# Altium project ProbadorDeCables.PrjPcb
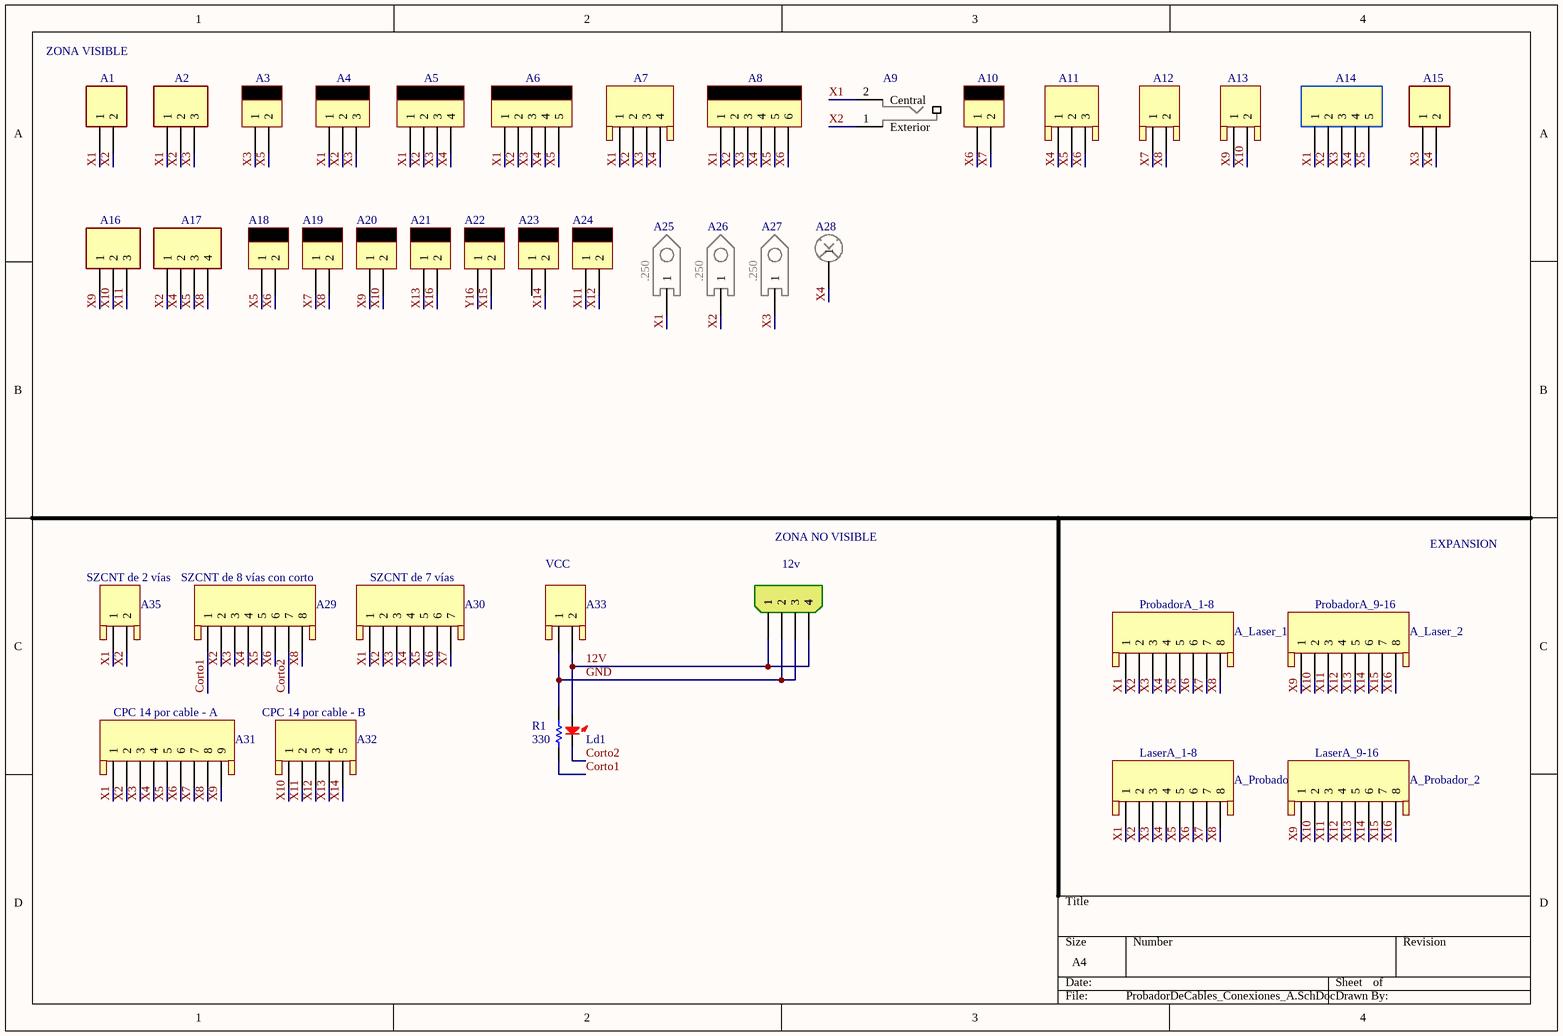
[diagram p0: ProbadorDeCables_Conexiones_A.SchDoc]
12 sheets, 118 parts. Net scope: global (net labels, ports and power ports of the same name join across sheets).
Board file: ProbadorDeCables.PcbDoc
Sheets:
  ProbadorDeCables_Conexiones_A.SchDoc
  ProbadorDeCables_Conexiones_B.SchDoc
  ProbadorDeCables_Accesorios_A.SchDoc
  ProbadorDeCables_Accesorios_A_SZCNT_2.SchDoc
  ProbadorDeCables_Accesorios_A_RCA.SchDoc
  ProbadorDeCables_Accesorios_B_SZCNT_2.SchDoc
  ProbadorDeCables_Accesorios_B_SZCNT_7.SchDoc
  ProbadorDeCables_Accesorios_B_SZCNT_8.SchDoc
  ProbadorDeCables_Accesorios_B_RCA.SchDoc
  ProbadorDeCables_Accesorios_B_CST100_Bomba.SchDoc
  ProbadorDeCables_Accesorios_B_RJ11.SchDoc
  ProbadorDeCables_Accesorios_B_Interlock.SchDoc

## Sheet ProbadorDeCables_Conexiones_A.SchDoc
size A4

### Parts
12v  MAZ 103 y 104  [794285-1]  (value not drawn)
A1  JST_2.5_2  [B2B-XH-A]  (value not drawn)
A2  JST_2.5_3  [B3B-XH-A]  (value not drawn)
A3  Para_SL-156__640445-2  [640445-2]  (value not drawn)
A4  Para_SL-156__640445-3  [640445-3]  (value not drawn)
A5  Para_SL-156__640445-4  [640445-4]  (value not drawn)
A6  Para_SL-156__640445-5  [640445-5]  (value not drawn)
A7  Para_CST_100__640456-4  [640456-4]  (value not drawn)
A8  Para_SL-156__640445-6  [640445-6]  (value not drawn)
A9  RCA mono para placa - Negro  [RCJ-021]  (value not drawn)
A10  Para_SL-156__640445-2  [640445-2]  (value not drawn)
A11  Para_CST_100__640456-3  [640456-3]  (value not drawn)
A12  Para_CST_100__640456-2  [640456-2]  (value not drawn)
A13  Para_CST_100__640456-2  [640456-2]  (value not drawn)
A14  USB 2_0 micro B  [USB2.0_MicroB]  (value not drawn)
A15  JST_2.5_2  [B2B-XH-A]  (value not drawn)
A16  JST_2.5_3  [B3B-XH-A]  (value not drawn)
A17  JST_2.5_4  [B4B-XH-A]  (value not drawn)
A18  Para_SL-156__640445-2  [640445-2]  (value not drawn)
A19  Para_SL-156__640445-2  [640445-2]  (value not drawn)
A20  Para_SL-156__640445-2  [640445-2]  (value not drawn)
A21  Para_SL-156__640445-2  [640445-2]  (value not drawn)
A22  Para_SL-156__640445-2  [640445-2]  (value not drawn)
A23  Para_SL-156__640445-2  [640445-2]  (value not drawn)
A24  Para_SL-156__640445-2  [640445-2]  (value not drawn)
A25  Pala macho 6.3 para placa  [Pala macho 6.3 para placa]  (value not drawn)
A26  Pala macho 6.3 para placa  [Pala macho 6.3 para placa]  (value not drawn)
A27  Pala macho 6.3 para placa  [Pala macho 6.3 para placa]  (value not drawn)
A28  SCREW M4 4 PIN PCB  [SCREW M4 4 PIN PCB]  (value not drawn)
A29  SZCNT de 8 vías con corto  [640456-8]
A30  SZCNT de 7 vías  [640456-7]
A31  CPC 14 por cable - A  [640456-9]
A32  CPC 14 por cable - B  [640456-5]
A33  VCC  [640456-2]
A35  SZCNT de 2 vías  [640456-2]
A_Laser_1  ProbadorA_1-8  [640456-8]
A_Laser_2  ProbadorA_9-16  [640456-8]
A_Probador_1  LaserA_1-8  [640456-8]
A_Probador_2  LaserA_9-16  [640456-8]
Ld1  PinesParaLed  [Jumper-Simple]  (value not drawn)
R1  330  [R_0805]

### Nets
12V: 12v.1 12v.4 A33.2 Ld1.1
Corto1: A29.1 R1.1
Corto2: A29.7 Ld1.2
GND: 12v.2 12v.3 A33.1 R1.2
X1: A1.1 A2.1 A4.1 A5.1 A6.1 A7.1 A8.1 A9.2(Central) A14.1 A25.1 A30.1 A31.1 A35.1 A_Laser_1.1 A_Probador_1.1
X2: A1.2 A2.2 A4.2 A5.2 A6.2 A7.2 A8.2 A9.1(Exterior) A14.2 A17.1 A26.1 A29.2 A30.2 A31.2 A35.2 A_Laser_1.2 A_Probador_1.2
X3: A2.3 A3.1 A4.3 A5.3 A6.3 A7.3 A8.3 A14.3 A15.1 A27.1 A29.3 A30.3 A31.3 A_Laser_1.3 A_Probador_1.3
X4: A5.4 A6.4 A7.4 A8.4 A11.1 A14.4 A15.2 A17.2 A28.1 A29.4 A30.4 A31.4 A_Laser_1.4 A_Probador_1.4
X5: A3.2 A6.5 A8.5 A11.2 A14.5 A17.3 A18.1 A29.5 A30.5 A31.5 A_Laser_1.5 A_Probador_1.5
X6: A8.6 A10.1 A11.3 A18.2 A29.6 A30.6 A31.6 A_Laser_1.6 A_Probador_1.6
X7: A10.2 A12.1 A19.1 A30.7 A31.7 A_Laser_1.7 A_Probador_1.7
X8: A12.2 A17.4 A19.2 A29.8 A31.8 A_Laser_1.8 A_Probador_1.8
X9: A13.1 A16.1 A20.1 A31.9 A_Laser_2.1 A_Probador_2.1
X10: A13.2 A16.2 A20.2 A32.1 A_Laser_2.2 A_Probador_2.2
X11: A16.3 A24.1 A32.2 A_Laser_2.3 A_Probador_2.3
X12: A24.2 A32.3 A_Laser_2.4 A_Probador_2.4
X13: A21.1 A32.4 A_Laser_2.5 A_Probador_2.5
X14: A23.2 A32.5 A_Laser_2.6 A_Probador_2.6
X15: A22.2 A_Laser_2.7 A_Probador_2.7
X16: A21.2 A_Laser_2.8 A_Probador_2.8
Y16: A22.1

Not connected (* = marked no-connect by the designer): A23 1

### Notes on the sheet
- ZONA VISIBLE
- ZONA NO VISIBLE
- EXPANSION
- (in symbol Pala macho 6.3 para placa) .250

### Library data of the parts
12v = 794285-1: CONN HDR 4POS 0.2 TIN PCB; Fabricante: TE Connectivity AMP Connectors; Cod.Digikey: 794285-1-ND; Cod.Fabricante: 794285-1; DIGIKEYx100: 1.68330; ComponentLink2URL: https://www.te.com/commerce/DocumentDelivery/DDEController?Action=srchrtrv&DocNm=794285&DocType=Customer+Drawing&DocLang=English; ComponentLink2Description: Datasheet
A1 A15 = JST_2.5_2: CONN HEADER XH TOP 2POS 2.5MM; Cod.Fabricante: B2B-XH-A(LF)(SN); Fabricante: JST Sales America Inc.; LatestRevisionDate: 17-Jul-2002; LatestRevisionNote: Re-released for DXP Platform.; Publisher: Altium Limited; Cod.Digikey: 455-2247-ND; DIGIKEYx50: 0.08980; ComponentLink2URL: http://www.jst-mfg.com/product/pdf/eng/eXH.pdf; ComponentLink2Description: Datasheet
A2 A16 = JST_2.5_3: CONN HEADER XH TOP 3POS 2.5MM; Cod.Fabricante: B3B-XH-A(LF)(SN); Fabricante: JST Sales America Inc.; LatestRevisionDate: 17-Jul-2002; LatestRevisionNote: Re-released for DXP Platform.; Publisher: Altium Limited; Cod.Digikey: 455-2248-ND; ComponentLink2Description: Datasheet; ComponentLink2URL: http://www.jst-mfg.com/product/pdf/eng/eXH.pdf; DIGIKEYx50: 0.11540
A3 A10 A18-A24 = Para_SL-156__640445-2: CONN HEADER VERT 2POS .156 TIN; Fabricante: TE Connectivity AMP Connectors; Cod.Digikey: A1971-ND; Cod.Fabricante: 640445-2; DIGIKEYx100: 0.07960; ComponentLink2URL: https://www.te.com/commerce/DocumentDelivery/DDEController?Action=srchrtrv&DocNm=640445&DocType=Customer+Drawing&DocLang=English; ComponentLink2Description: Datasheet
A4 = Para_SL-156__640445-3: CONN HEADER VERT 3POS .156 TIN; Fabricante: TE Connectivity AMP Connectors; Cod.Digikey: A19890-ND; Cod.Fabricante: 640445-3; DIGIKEYx100: 0.13710; ComponentLink2URL: https://www.te.com/commerce/DocumentDelivery/DDEController?Action=srchrtrv&DocNm=640445&DocType=Customer+Drawing&DocLang=English; ComponentLink2Description: Datasheet
A5 = Para_SL-156__640445-4: CONN HEADER VERT 4POS .156 TIN; Fabricante: TE Connectivity AMP Connectors; Cod.Digikey: A1972-ND; Cod.Fabricante: 640445-4; DIGIKEYx100: 0.18210; ComponentLink2URL: https://www.te.com/commerce/DocumentDelivery/DDEController?Action=srchrtrv&DocNm=640445&DocType=Customer+Drawing&DocLang=English; ComponentLink2Description: Datasheet
A6 = Para_SL-156__640445-5: CONN HEADER VERT 5POS .156 TIN; Fabricante: TE Connectivity AMP Connectors; Cod.Digikey: A19891-ND; Cod.Fabricante: 640445-5; DIGIKEYx100: 0.23490; ComponentLink2URL: https://www.te.com/commerce/DocumentDelivery/DDEController?Action=srchrtrv&DocNm=640445&DocType=Customer+Drawing&DocLang=English; ComponentLink2Description: Datasheet
A7 = Para_CST_100__640456-4: CONN HEADER VERT 4POS .100 TIN; Cod.Fabricante: 640456-2; Fabricante: TE Connectivity AMP Connectors; LatestRevisionDate: 17-Jul-2002; LatestRevisionNote: Re-released for DXP Platform.; Publisher: Altium Limited; Cod.Digikey: A1922-ND; DIGIKEYx100: 0.14850; ComponentLink2URL: http://www.te.com/commerce/DocumentDelivery/DDEController?Action=srchrtrv&DocNm=640456&DocType=Customer+Drawing&DocLang=English; ComponentLink2Description: Datasheet
A8 = Para_SL-156__640445-6: CONN HEADER VERT 6POS .156 TIN; Fabricante: TE Connectivity AMP Connectors; Cod.Digikey: A1973-ND; Cod.Fabricante: 640445-6; DIGIKEYx100: 0.28780; ComponentLink2URL: https://www.te.com/commerce/DocumentDelivery/DDEController?Action=srchrtrv&DocNm=640445&DocType=Customer+Drawing&DocLang=English; ComponentLink2Description: Datasheet
A9 = RCA mono para placa - Negro: CONN RCA JACK MONO 3.2MM PCB; Fabricante: CUI Devices; Cod.Digikey: CP-1406-ND; Cod.Fabricante: RCJ-021; DIGIKEYx100: 0.66880; ComponentLink2URL: https://www.cuidevices.com/product/resource/digikeypdf/rcj-02x.pdf; ComponentLink2Description: Datasheet
A11 = Para_CST_100__640456-3: CONN HEADER VERT 3POS .100 TIN; Fabricante: TE Connectivity AMP Connectors; LatestRevisionDate: 17-Jul-2002; LatestRevisionNote: Re-released for DXP Platform.; Publisher: Altium Limited; Cod.Digikey: A19470-ND; Cod.Fabricante: 640456-3; DIGIKEYx100: 0.08910; ComponentLink2URL: http://www.te.com/commerce/DocumentDelivery/DDEController?Action=srchrtrv&DocNm=640456&DocType=Customer+Drawing&DocLang=English; ComponentLink2Description: Datasheet
A12 A13 A33 A35 = Para_CST_100__640456-2: CONN HEADER VERT 2POS .100 TIN; Fabricante: TE Connectivity AMP Connectors; LatestRevisionDate: 17-Jul-2002; LatestRevisionNote: Re-released for DXP Platform.; Publisher: Altium Limited; Cod.Digikey: A1921-ND; Cod.Fabricante: 640456-2; DIGIKEYx100: 0.06630; ComponentLink2URL: http://www.te.com/commerce/DocumentDelivery/DDEController?Action=srchrtrv&DocNm=640456&DocType=Customer+Drawing&DocLang=English; ComponentLink2Description: Datasheet
A14 = USB 2_0 micro B: CONN RCPT USB2.0 MICRO B SMD R/A; Cod.Fabricante: USB3160-30-0170-0-C; Fabricante: GCT; Cod.Digikey: 2073-USB3160-30-0170-0-CCT-ND; ComponentLink2Description: Datasheet; ComponentLink2URL: https://gct.co/files/drawings/usb3160.pdf; DIGIKEYx100: 0.57750
A17 = JST_2.5_4: CONN HEADER XH TOP 4POS 2.5MM; Cod.Fabricante: B4B-XH-A(LF)(SN); Fabricante: JST Sales America Inc.; LatestRevisionDate: 17-Jul-2002; LatestRevisionNote: Re-released for DXP Platform.; Publisher: Altium Limited; Cod.Digikey: 455-2249-ND; ComponentLink2Description: Datasheet; ComponentLink2URL: http://www.jst-mfg.com/product/pdf/eng/eXH.pdf; DIGIKEYx100: 0.13480
A25-A27 = Pala macho 6.3 para placa: CONN QC TAB 0.250 SOLDER; Cod.Fabricante: 1217125-1; Fabricante: TE Connectivity AMP Connectors; Cod.DigiKey: A110909CT-ND; ComponentLink1Description: Manufacturer Link; ComponentLink1URL: https://www.te.com/commerce/DocumentDelivery/DDEController?Action=srchrtrv&DocNm=1217125&DocType=Customer+Drawing&DocLang=English; DIGIKEYx100: 0.17180
A28 = SCREW M4 4 PIN PCB: TERM SCREW M4 4 PIN PCB; Cod.Fabricante: 7795; Fabricante: Keystone Electronics; Cod.Digikey: 36-7795-ND; DIGIKEYx100: 0.38960; ComponentLink2URL: http://keyelco.com/userAssets/file/M65p69.pdf; ComponentLink2Description: Datasheet
A29 A_Laser_1 A_Laser_2 A_Probador_1 A_Probador_2 = Para_CST_100__640456-8: CONN HEADER VERT 8POS .100 TIN; Fabricante: TE Connectivity AMP Connectors; Cod.Digikey: A1924-ND; Cod.Fabricante: 640456-8; DIGIKEYx100: 0.29070; ComponentLink2URL: http://www.te.com/commerce/DocumentDelivery/DDEController?Action=srchrtrv&DocNm=640456&DocType=Customer+Drawing&DocLang=English; ComponentLink2Description: Datasheet
  A29: LatestRevisionDate: 17-Jul-2002; LatestRevisionNote: Re-released for DXP Platform.; Publisher: Altium Limited
A30 = Para_CST_100__640456-7: CONN HEADER VERT 7POS .100 TIN; Fabricante: TE Connectivity AMP Connectors; LatestRevisionDate: 17-Jul-2002; LatestRevisionNote: Re-released for DXP Platform.; Publisher: Altium Limited; Cod.Digikey: A19472-ND; Cod.Fabricante: 640456-7; DIGIKEYx100: 0.27260; ComponentLink2URL: http://www.te.com/commerce/DocumentDelivery/DDEController?Action=srchrtrv&DocNm=640456&DocType=Customer+Drawing&DocLang=English; ComponentLink2Description: Datasheet
A31 = Para_CST_100__640456-9: CONN HEADER VERT 9POS .100 TIN; Fabricante: TE Connectivity AMP Connectors; LatestRevisionDate: 17-Jul-2002; LatestRevisionNote: Re-released for DXP Platform.; Publisher: Altium Limited; Cod.Digikey: A19473-ND; Cod.Fabricante: 640456-9; DIGIKEYx100: 0.41390; ComponentLink2URL: http://www.te.com/commerce/DocumentDelivery/DDEController?Action=srchrtrv&DocNm=640456&DocType=Customer+Drawing&DocLang=English; ComponentLink2Description: Datasheet
A32 = Para_CST_100__640456-5: CONN HEADER VERT 5POS .100 TIN; Fabricante: TE Connectivity AMP Connectors; LatestRevisionDate: 17-Jul-2002; LatestRevisionNote: Re-released for DXP Platform.; Publisher: Altium Limited; Cod.Digikey: A19471-ND; Cod.Fabricante: 640456-5; DIGIKEYx100: 0.20780; ComponentLink2URL: http://www.te.com/commerce/DocumentDelivery/DDEController?Action=srchrtrv&DocNm=640456&DocType=Customer+Drawing&DocLang=English; ComponentLink2Description: Datasheet
Ld1 = PinesParaLed: CONN HEADER 2 POS 2.54; Cod.Fabricante: 61300211121; Fabricante: Wurth Electronics Inc.; Cod.DigiKey: 732-5315-ND; ComponentLink1Description: Manufacturer Link; ComponentLink1URL: https://katalog.we-online.de/em/datasheet/6130xx11121.pdf; ComponentLink2Description: Datasheet; ComponentLink2URL: *; DatasheetVersion: *; DIGIKEYx100: 0.06700; LatestRevisionDate: *; LatestRevisionNote: *; PackageDescription: *; PackageReference: *; PackageVersion: *; Published: 29-sep-00; Publisher: Altium Limited; Value: *
R1 = R_330_0805: RES SMD 330 OHM 1% 1/8W 0805; Cod.Fabricante: RC0805FR-07330RL; Fabricante: Yageo; Published: 8-Jun-2000; LatestRevisionDate: 17-Jul-2002; LatestRevisionNote: Re-released for DXP Platform.; PackageReference: 0805; Publisher: Altium Limited; Cod.Digikey: 311-330CRCT-ND; Value: 330; DIGIKEYx100: 0.01630

## Sheet ProbadorDeCables_Conexiones_B.SchDoc
size A4
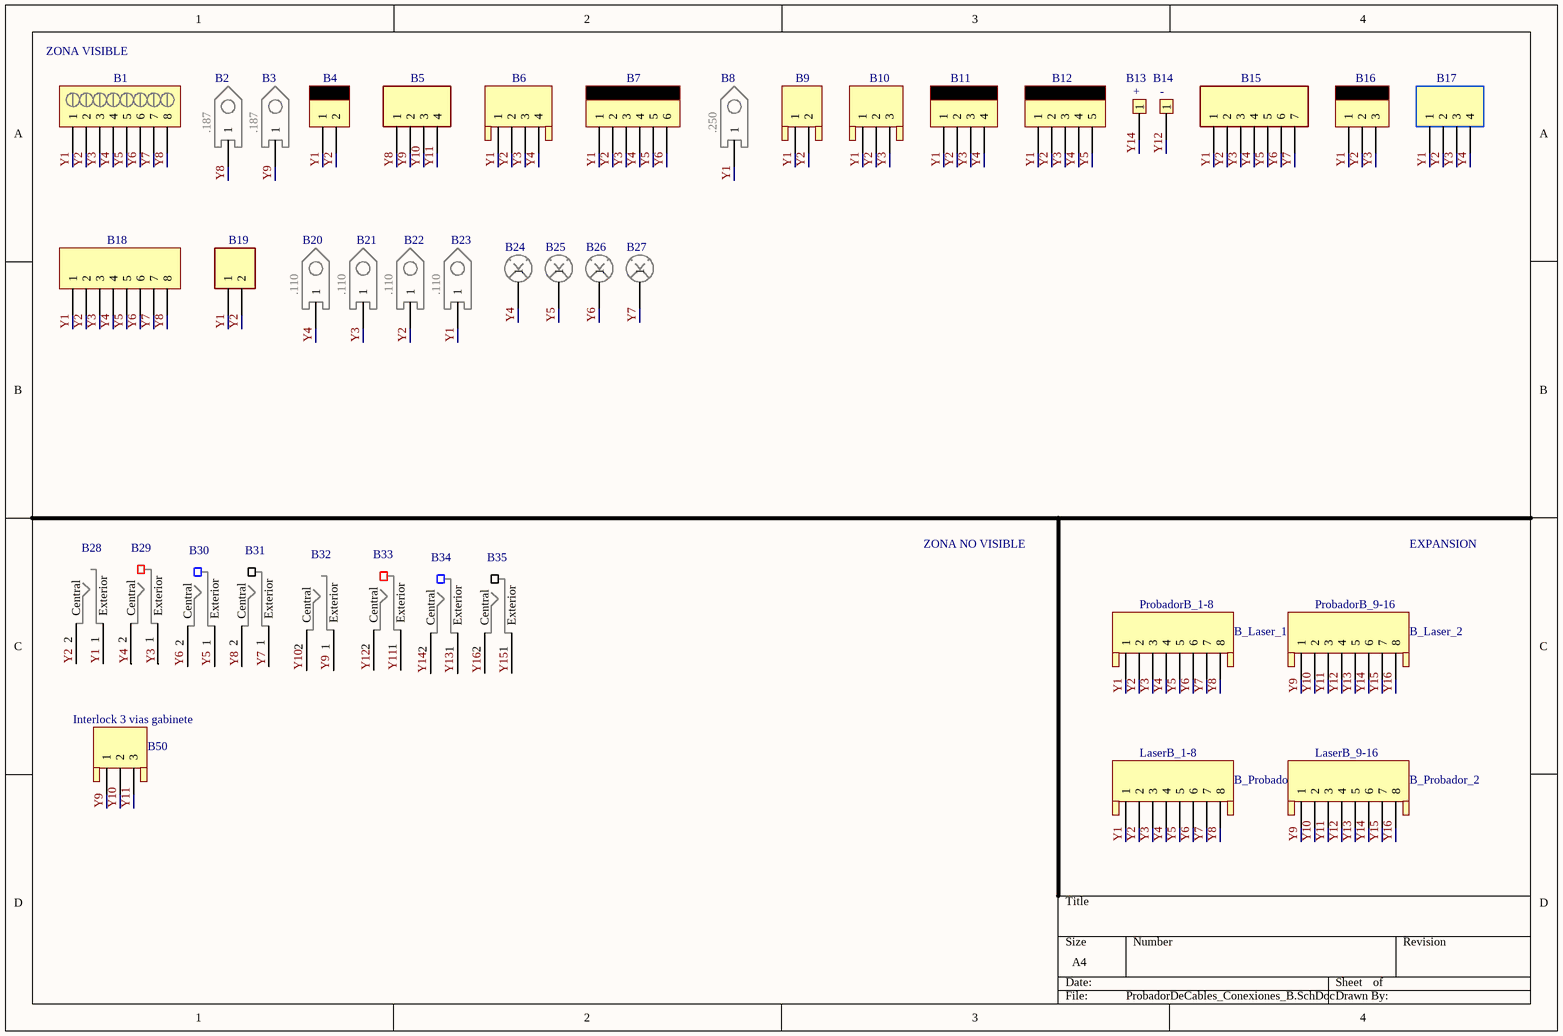
[diagram p1: ProbadorDeCables_Conexiones_B.SchDoc]

### Parts
B1  Bornera con tornillos 8 vías  [Bornera con tornillos 8 vías]  (value not drawn)
B2  Pala macho 4.8 para placa  [Pala macho 4.8 para placa]  (value not drawn)
B3  Pala macho 4.8 para placa  [Pala macho 4.8 para placa]  (value not drawn)
B4  Para_SL-156__640445-2  [640445-2]  (value not drawn)
B5  JST_2.5_4  [B4B-XH-A]  (value not drawn)
B6  Para_CST_100__640456-4  [640456-4]  (value not drawn)
B7  Para_SL-156__640445-6  [640445-6]  (value not drawn)
B8  Pala macho 6.3 para placa  [Pala macho 6.3 para placa]  (value not drawn)
B9  Para_CST_100__640456-2  [640456-2]  (value not drawn)
B10  Para_CST_100__640456-3  [640456-3]  (value not drawn)
B11  Para_SL-156__640445-4  [640445-4]  (value not drawn)
B12  Para_SL-156__640445-5  [640445-5]  (value not drawn)
B13  +  [Pin macho para crio]
B14  -  [Pin macho para crio]
B15  JST_2.5_7  [B7B-XH-A]  (value not drawn)
B16  Para_SL-156__640445-3  [640445-3]  (value not drawn)
B17  USB 2_0 A  [USB2.0_A]  (value not drawn)
B18  Fuente MSP-300-15  [DF11-8DP-2DSA(01)]  (value not drawn)
B19  JST_2.5_2  [B2B-XH-A]  (value not drawn)
B20  Pala macho 2.7 para placa  [Pala macho 2.7 para placa]  (value not drawn)
B21  Pala macho 2.7 para placa  [Pala macho 2.7 para placa]  (value not drawn)
B22  Pala macho 2.7 para placa  [Pala macho 2.7 para placa]  (value not drawn)
B23  Pala macho 2.7 para placa  [Pala macho 2.7 para placa]  (value not drawn)
B24  Tornillo M4 para placa  [SCREW M4 4 PIN PCB]  (value not drawn)
B25  Tornillo M4 para placa  [SCREW M4 4 PIN PCB]  (value not drawn)
B26  Tornillo M4 para placa  [SCREW M4 4 PIN PCB]  (value not drawn)
B27  Tornillo M4 para placa  [SCREW M4 4 PIN PCB]  (value not drawn)
B28  RCA mono para placa - Blanco  [RCJ-023]  (value not drawn)
B29  RCA mono para placa - Rojo  [RCJ-022]  (value not drawn)
B30  RCA mono para placa - Azul  [RCJ-025]  (value not drawn)
B31  RCA mono para placa - Negro  [RCJ-021]  (value not drawn)
B32  RCA mono para placa - Blanco  [RCJ-023]  (value not drawn)
B33  RCA mono para placa - Rojo  [RCJ-022]  (value not drawn)
B34  RCA mono para placa - Azul  [RCJ-025]  (value not drawn)
B35  RCA mono para placa - Negro  [RCJ-021]  (value not drawn)
B50  Interlock 3 vias gabinete  [640456-3]
B_Laser_1  ProbadorB_1-8  [640456-8]
B_Laser_2  ProbadorB_9-16  [640456-8]
B_Probador_1  LaserB_1-8  [640456-8]
B_Probador_2  LaserB_9-16  [640456-8]

### Nets
Y1: B1.1 B4.1 B6.1 B7.1 B8.1 B9.1 B10.1 B11.1 B12.1 B15.1 B16.1 B17.1 B18.1 B19.1 B23.1 B28.1(Exterior) B_Laser_1.1 B_Probador_1.1
Y2: B1.2 B4.2 B6.2 B7.2 B9.2 B10.2 B11.2 B12.2 B15.2 B16.2 B17.2 B18.2 B19.2 B22.1 B28.2(Central) B_Laser_1.2 B_Probador_1.2
Y3: B1.3 B6.3 B7.3 B10.3 B11.3 B12.3 B15.3 B16.3 B17.3 B18.3 B21.1 B29.1(Exterior) B_Laser_1.3 B_Probador_1.3
Y4: B1.4 B6.4 B7.4 B11.4 B12.4 B15.4 B17.4 B18.4 B20.1 B24.1 B29.2(Central) B_Laser_1.4 B_Probador_1.4
Y5: B1.5 B7.5 B12.5 B15.5 B18.5 B25.1 B30.1(Exterior) B_Laser_1.5 B_Probador_1.5
Y6: B1.6 B7.6 B15.6 B18.6 B26.1 B30.2(Central) B_Laser_1.6 B_Probador_1.6
Y7: B1.7 B15.7 B18.7 B27.1 B31.1(Exterior) B_Laser_1.7 B_Probador_1.7
Y8: B1.8 B2.1 B5.1 B18.8 B31.2(Central) B_Laser_1.8 B_Probador_1.8
Y9: B3.1 B5.2 B32.1(Exterior) B50.1 B_Laser_2.1 B_Probador_2.1
Y10: B5.3 B32.2(Central) B50.2 B_Laser_2.2 B_Probador_2.2
Y11: B5.4 B33.1(Exterior) B50.3 B_Laser_2.3 B_Probador_2.3
Y12: B14.1 B33.2(Central) B_Laser_2.4 B_Probador_2.4
Y13: B34.1(Exterior) B_Laser_2.5 B_Probador_2.5
Y14: B13.1 B34.2(Central) B_Laser_2.6 B_Probador_2.6
Y15: B35.1(Exterior) B_Laser_2.7 B_Probador_2.7
Y16: B35.2(Central) B_Laser_2.8 B_Probador_2.8

### Notes on the sheet
- ZONA VISIBLE
- ZONA NO VISIBLE
- EXPANSION
- (in symbol Pala macho 2.7 para placa) .110
- (in symbol Pala macho 4.8 para placa) .187
- (in symbol Pala macho 6.3 para placa) .250

### Library data of the parts
B1 = Bornera con tornillos 8 vías: TERMINAL BLOCK SCREW TYPE 5.08; Cod.Fabricante: TB008A-508-08BE; Fabricante: CUI Devices; Cod.Digikey: 102-6216-ND; DIGIKEYx100: 1.03600; ComponentLink2URL: https://www.cuidevices.com/product/resource/digikeypdf/tb008a-508.pdf; ComponentLink2Description: Datasheet
B2 B3 = Pala macho 4.8 para placa: CONN QC TAB 0.187 SOLDER; Cod.Fabricante: 1217124-1; Fabricante: TE Connectivity AMP Connectors; Cod.DigiKey: A110908CT-ND; ComponentLink1Description: Manufacturer Link; ComponentLink1URL: https://www.te.com/commerce/DocumentDelivery/DDEController?Action=srchrtrv&DocNm=1217124&DocType=Customer+Drawing&DocLang=English; DIGIKEYx100: 0.13260
B4 = Para_SL-156__640445-2: as A3 on sheet ProbadorDeCables_Conexiones_A; Cod.Digikey: A1971-ND; Cod.Fabricante: 640445-2; DIGIKEYx100: 0.07960; ComponentLink2URL: https://www.te.com/commerce/DocumentDelivery/DDEController?Action=srchrtrv&DocNm=640445&DocType=Customer+Drawing&DocLang=English; ComponentLink2Description: Datasheet
B5 = JST_2.5_4: as A17 on sheet ProbadorDeCables_Conexiones_A; LatestRevisionDate: 17-Jul-2002; LatestRevisionNote: Re-released for DXP Platform.; Publisher: Altium Limited; Cod.Digikey: 455-2249-ND; ComponentLink2Description: Datasheet; ComponentLink2URL: http://www.jst-mfg.com/product/pdf/eng/eXH.pdf; DIGIKEYx100: 0.13480
B6 = Para_CST_100__640456-4: as A7 on sheet ProbadorDeCables_Conexiones_A; LatestRevisionDate: 17-Jul-2002; LatestRevisionNote: Re-released for DXP Platform.; Publisher: Altium Limited; Cod.Digikey: A1922-ND; DIGIKEYx100: 0.14850; ComponentLink2URL: http://www.te.com/commerce/DocumentDelivery/DDEController?Action=srchrtrv&DocNm=640456&DocType=Customer+Drawing&DocLang=English; ComponentLink2Description: Datasheet
B7 = Para_SL-156__640445-6: as A8 on sheet ProbadorDeCables_Conexiones_A; Cod.Digikey: A1973-ND; Cod.Fabricante: 640445-6; DIGIKEYx100: 0.28780; ComponentLink2URL: https://www.te.com/commerce/DocumentDelivery/DDEController?Action=srchrtrv&DocNm=640445&DocType=Customer+Drawing&DocLang=English; ComponentLink2Description: Datasheet
B8 = Pala macho 6.3 para placa: as A25 on sheet ProbadorDeCables_Conexiones_A; Cod.DigiKey: A110909CT-ND; ComponentLink1Description: Manufacturer Link; ComponentLink1URL: https://www.te.com/commerce/DocumentDelivery/DDEController?Action=srchrtrv&DocNm=1217125&DocType=Customer+Drawing&DocLang=English; DIGIKEYx100: 0.17180
B9 = Para_CST_100__640456-2: as A12 on sheet ProbadorDeCables_Conexiones_A; LatestRevisionDate: 17-Jul-2002; LatestRevisionNote: Re-released for DXP Platform.; Publisher: Altium Limited; Cod.Digikey: A1921-ND; Cod.Fabricante: 640456-2; DIGIKEYx100: 0.06630; ComponentLink2URL: http://www.te.com/commerce/DocumentDelivery/DDEController?Action=srchrtrv&DocNm=640456&DocType=Customer+Drawing&DocLang=English; ComponentLink2Description: Datasheet
B10 B50 = Para_CST_100__640456-3: as A11 on sheet ProbadorDeCables_Conexiones_A; LatestRevisionDate: 17-Jul-2002; LatestRevisionNote: Re-released for DXP Platform.; Publisher: Altium Limited; Cod.Digikey: A19470-ND; Cod.Fabricante: 640456-3; DIGIKEYx100: 0.08910; ComponentLink2URL: http://www.te.com/commerce/DocumentDelivery/DDEController?Action=srchrtrv&DocNm=640456&DocType=Customer+Drawing&DocLang=English; ComponentLink2Description: Datasheet
B11 = Para_SL-156__640445-4: as A5 on sheet ProbadorDeCables_Conexiones_A; Cod.Digikey: A1972-ND; Cod.Fabricante: 640445-4; DIGIKEYx100: 0.18210; ComponentLink2URL: https://www.te.com/commerce/DocumentDelivery/DDEController?Action=srchrtrv&DocNm=640445&DocType=Customer+Drawing&DocLang=English; ComponentLink2Description: Datasheet
B12 = Para_SL-156__640445-5: as A6 on sheet ProbadorDeCables_Conexiones_A; Cod.Digikey: A19891-ND; Cod.Fabricante: 640445-5; DIGIKEYx100: 0.23490; ComponentLink2URL: https://www.te.com/commerce/DocumentDelivery/DDEController?Action=srchrtrv&DocNm=640445&DocType=Customer+Drawing&DocLang=English; ComponentLink2Description: Datasheet
B13 B14 = Pin macho para crio: CONN PC PIN CIRC 0.058DIA TIN; Cod.Fabricante: 3-60599-1; Fabricante: TE Connectivity AMP Connectors; Cod.DigiKey: 3-60599-1-ND; ComponentLink1Description: Manufacturer Link; ComponentLink1URL: http://www.keyelco.com/product-pdf.cfm?p=1054; DIGIKEYx50: 0.74940; DIGIKEYx100: 0.71680
B15 = JST_2.5_7: CONN HEADER XH TOP 7POS 2.5MM; Cod.Fabricante: B7B-XH-A(LF)(SN); Fabricante: JST Sales America Inc.; LatestRevisionDate: 17-Jul-2002; LatestRevisionNote: Re-released for DXP Platform.; Publisher: Altium Limited; Cod.Digikey: 455-2252-ND; ComponentLink2Description: Datasheet; ComponentLink2URL: http://www.jst-mfg.com/product/pdf/eng/eXH.pdf; DIGIKEYx100: 0.2156
B16 = Para_SL-156__640445-3: as A4 on sheet ProbadorDeCables_Conexiones_A; Cod.Digikey: A19890-ND; Cod.Fabricante: 640445-3; DIGIKEYx100: 0.13710; ComponentLink2URL: https://www.te.com/commerce/DocumentDelivery/DDEController?Action=srchrtrv&DocNm=640445&DocType=Customer+Drawing&DocLang=English; ComponentLink2Description: Datasheet
B17 = USB 2_0 A: CONN RCPT USB2.0 TYPEA 4POS VERT; Cod.Fabricante: 1050570001; Fabricante: Molex; Cod.Digikey: WM8672-ND; ComponentLink2Description: Datasheet; ComponentLink2URL: https://www.molex.com/pdm_docs/sd/1050570001_sd.pdf; DIGIKEYx100: 0.69030
B18 = DF11-8DP-2DSA(01): CONN HEADER VERT 8POS 2MM; Fabricante: Hirose Electric Co Ltd; LatestRevisionDate: 17-Jul-2002; LatestRevisionNote: Re-released for DXP Platform.; Publisher: Altium Limited; Cod.Digikey: H2852-ND; Cod.Fabricante: DF11-8DP-2DSA(01); DIGIKEYx100: 0.72600; ComponentLink2URL: https://www.hirose.com/product/download/?distributor=digikey&type=specSheet&lang=en&num=DF11-8DP-2DSA(01); ComponentLink2Description: Datasheet
B19 = JST_2.5_2: as A1 on sheet ProbadorDeCables_Conexiones_A; LatestRevisionDate: 17-Jul-2002; LatestRevisionNote: Re-released for DXP Platform.; Publisher: Altium Limited; Cod.Digikey: 455-2247-ND; DIGIKEYx50: 0.08980; ComponentLink2URL: http://www.jst-mfg.com/product/pdf/eng/eXH.pdf; ComponentLink2Description: Datasheet
B20-B23 = Pala macho 2.7 para placa: CONN QC TAB 0.110 SOLDER; Cod.Fabricante: 735187-2; Fabricante: TE Connectivity AMP Connectors; Cod.DigiKey: A107001-ND; ComponentLink1Description: Manufacturer Link; ComponentLink1URL: https://www.te.com/commerce/DocumentDelivery/DDEController?Action=srchrtrv&DocNm=735187&DocType=Customer+Drawing&DocLang=English; DIGIKEYx100: 0.11110
B24-B27 = Tornillo M4 para placa: TERM SCREW M4 4 PIN PCB; Cod.Fabricante: 7795; Fabricante: Keystone Electronics; Cod.Digikey: 36-7795-ND; DIGIKEYx100: 0.38960; ComponentLink2URL: http://keyelco.com/userAssets/file/M65p69.pdf; ComponentLink2Description: Datasheet
B28 B32 = RCA mono para placa - Blanco: CONN RCA JACK MONO 3.2MM PCB; Fabricante: CUI Devices; Cod.Digikey: CP-1408-ND; Cod.Fabricante: RCJ-023; DIGIKEYx100: 0.66880; ComponentLink2URL: https://www.cuidevices.com/product/resource/digikeypdf/rcj-02x.pdf; ComponentLink2Description: Datasheet
B29 B33 = RCA mono para placa - Rojo: CONN RCA JACK MONO 3.2MM PCB; Fabricante: CUI Devices; Cod.Digikey: CP-1407-ND; Cod.Fabricante: RCJ-022; DIGIKEYx100: 0.66880; ComponentLink2URL: https://www.cuidevices.com/product/resource/digikeypdf/rcj-02x.pdf; ComponentLink2Description: Datasheet
B30 B34 = RCA mono para placa - Azul: CONN RCA JACK MONO 3.2MM PCB; Fabricante: CUI Devices; Cod.Digikey: CP-1410-ND; Cod.Fabricante: RCJ-025; DIGIKEYx100: 0.66880; ComponentLink2URL: https://www.cuidevices.com/product/resource/digikeypdf/rcj-02x.pdf; ComponentLink2Description: Datasheet
B31 B35 = RCA mono para placa - Negro: as A9 on sheet ProbadorDeCables_Conexiones_A; Cod.Digikey: CP-1406-ND; Cod.Fabricante: RCJ-021; DIGIKEYx100: 0.66880; ComponentLink2URL: https://www.cuidevices.com/product/resource/digikeypdf/rcj-02x.pdf; ComponentLink2Description: Datasheet
B_Laser_1 B_Laser_2 B_Probador_1 B_Probador_2 = Para_CST_100__640456-8: as A29 on sheet ProbadorDeCables_Conexiones_A; Cod.Digikey: A1924-ND; Cod.Fabricante: 640456-8; DIGIKEYx100: 0.29070; ComponentLink2URL: http://www.te.com/commerce/DocumentDelivery/DDEController?Action=srchrtrv&DocNm=640456&DocType=Customer+Drawing&DocLang=English; ComponentLink2Description: Datasheet

## Sheet ProbadorDeCables_Accesorios_A.SchDoc
size A4
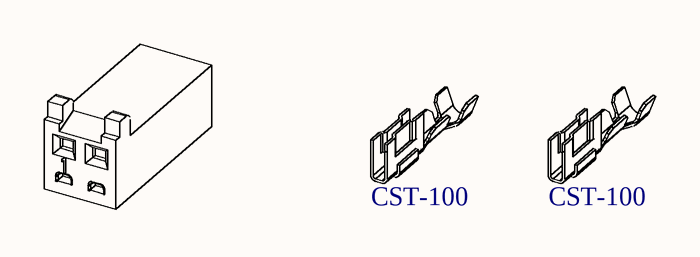
[diagram p2: ProbadorDeCables_Accesorios_A.SchDoc]

### Parts
BOM__A34  CST-100-2  [BOM_CST-100-2]  (value not drawn)  (mechanical)
BOM__A34__1  ParaHousing: CST-100  [BOM_sock_CST_1375819-1]  (hidden comment: sock_CST_1375819-1)  (mechanical)
BOM__A34__2  ParaHousing: CST-100  [BOM_sock_CST_1375819-1]  (hidden comment: sock_CST_1375819-1)  (mechanical)

### Library data of the parts
BOM__A34 = CST-100-2: CONN RCPT HSNG 2POS CST-100 II; Cod.Fabricante: 1375820-2; Fabricante: TE Connectivity AMP Connectors; Cod.DigiKey: A99613-ND; ComponentLink1Description: Manufacturer Link; ComponentLink1URL: https://www.te.com/commerce/DocumentDelivery/DDEController?Action=srchrtrv&DocNm=1375820&DocType=Customer+Drawing&DocLang=English; DIGIKEYx50: 0.08380; DIGIKEYx100: NO
BOM__A34__1 BOM__A34__2 = sock_CST_1375819-1: CONN SOCKET 22-26AWG CRIMP TIN; Fabricante: TE Connectivity AMP Connectors; Cod.DigiKey: A100453CT-ND; Cod.Fabricante: 1375819-1; ComponentLink1Description: Manufacturer Link; ComponentLink1URL: https://www.te.com/commerce/DocumentDelivery/DDEController?Action=srchrtrv&DocNm=1375819&DocType=Customer+Drawing&DocLang=English; DIGIKEYx100: 0.04210; DIGIKEYx50: 0.03960

## Sheet ProbadorDeCables_Accesorios_A_SZCNT_2.SchDoc
size A4
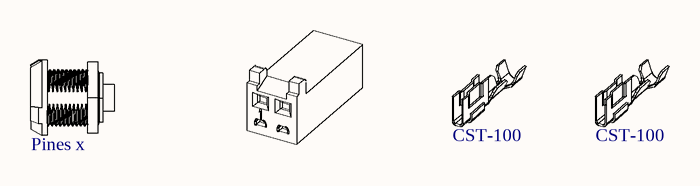
[diagram p3: ProbadorDeCables_Accesorios_A_SZCNT_2.SchDoc]

### Parts
BOM_A35  Pines: Pines x  [BOM_SZCNT_Hembra]  (hidden comment: SZCNT_0x_Hembra)  (mechanical)
BOM_A35__1  CST-100-2  [BOM_CST-100-2]  (value not drawn)  (mechanical)
BOM_A35__2  ParaHousing: CST-100  [BOM_sock_CST_1375819-1]  (hidden comment: sock_CST_1375819-1)  (mechanical)
BOM_A35__3  ParaHousing: CST-100  [BOM_sock_CST_1375819-1]  (hidden comment: sock_CST_1375819-1)  (mechanical)

### Library data of the parts
BOM_A35 = SZCNT_0x_Hembra: Conector SZCNT x vías hembra para gabinete; Cod.DigiKey: Se compra a SZCNT; Cod.Fabricante: *; ComponentLink1Description: Manufacturer Link; ComponentLink1URL: *; DIGIKEYx100: *; Fabricante: SZCNT; DIGIKEYx50: *
BOM_A35__1 = CST-100-2: as BOM__A34 on sheet ProbadorDeCables_Accesorios_A; Cod.DigiKey: A99613-ND; ComponentLink1Description: Manufacturer Link; ComponentLink1URL: https://www.te.com/commerce/DocumentDelivery/DDEController?Action=srchrtrv&DocNm=1375820&DocType=Customer+Drawing&DocLang=English; DIGIKEYx50: 0.08380; DIGIKEYx100: NO
BOM_A35__2 BOM_A35__3 = sock_CST_1375819-1: as BOM__A34__1 on sheet ProbadorDeCables_Accesorios_A; Cod.DigiKey: A100453CT-ND; Cod.Fabricante: 1375819-1; ComponentLink1Description: Manufacturer Link; ComponentLink1URL: https://www.te.com/commerce/DocumentDelivery/DDEController?Action=srchrtrv&DocNm=1375819&DocType=Customer+Drawing&DocLang=English; DIGIKEYx100: 0.04210; DIGIKEYx50: 0.03960

## Sheet ProbadorDeCables_Accesorios_A_RCA.SchDoc
size A4
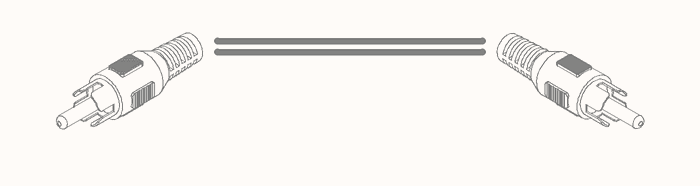
[diagram p4: ProbadorDeCables_Accesorios_A_RCA.SchDoc]

### Parts
A_RCA  RCP-023__Blanco  [BOM_RCP-023__Blanco]  (value not drawn)  (mechanical)
BOM_A_RCA__2  RCP-023__Blanco  [BOM_RCP-023__Blanco]  (value not drawn)  (mechanical)

### Library data of the parts
A_RCA BOM_A_RCA__2 = RCP-023__Blanco: CONN RCA PLUG MONO 2COND; Fabricante: CUI Devices; Cod.DigiKey: CP-1455-ND; Cod.Fabricante: RCP-023; ComponentLink1Description: Manufacturer Link; ComponentLink1URL: https://www.cuidevices.com/product/resource/digikeypdf/rcp-02x.pdf; DIGIKEYx50: 1.09940; DIGIKEYx100: 1.05160

## Sheet ProbadorDeCables_Accesorios_B_SZCNT_2.SchDoc
size A4
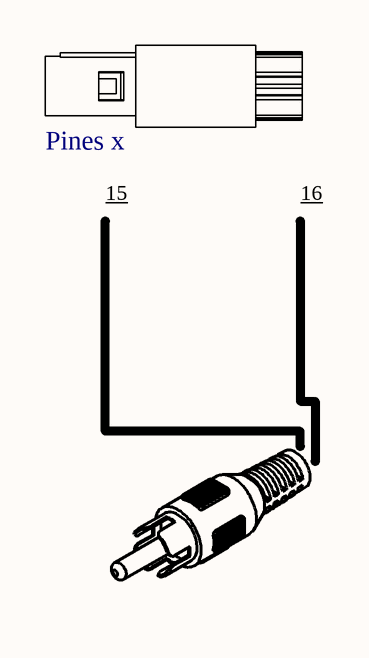
[diagram p5: ProbadorDeCables_Accesorios_B_SZCNT_2.SchDoc]

### Parts
B_SZCNT2  Pines: Pines x  [BOM_SZCNT_Macho]  (hidden comment: SZCNT_0x_Macho)  (mechanical)
BOM_B_SZCNT2  RCP-021__Negro  [BOM_RCP-021__Negro]  (value not drawn)  (mechanical)

### Notes on the sheet
- (near B_SZCNT2) 15
- 16

### Library data of the parts
B_SZCNT2 = SZCNT_0x_Macho: Conector SZCNT x vías macho para cable; Cod.DigiKey: Se compra a SZCNT; Cod.Fabricante: *; ComponentLink1Description: Manufacturer Link; ComponentLink1URL: *; DIGIKEYx100: *; Fabricante: SZCNT; DIGIKEYx50: *
BOM_B_SZCNT2 = RCP-021__Negro: CONN RCA PLUG MONO 2COND; Fabricante: CUI Devices; Cod.DigiKey: CP-1453-ND; Cod.Fabricante: RCP-021; ComponentLink1Description: Manufacturer Link; ComponentLink1URL: https://www.cuidevices.com/product/resource/digikeypdf/rcp-02x.pdf; DIGIKEYx50: 1.09940; DIGIKEYx100: 1.05160

## Sheet ProbadorDeCables_Accesorios_B_SZCNT_7.SchDoc
size A4
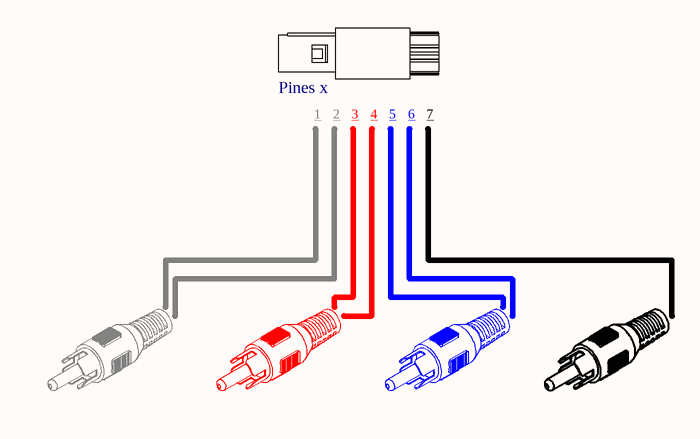
[diagram p6: ProbadorDeCables_Accesorios_B_SZCNT_7.SchDoc]

### Parts
B_SZCNT7  Pines: Pines x  [BOM_SZCNT_Macho]  (hidden comment: SZCNT_0x_Macho)  (mechanical)
BOM_B_SZCNT7__1  RCP-023__Blanco  [BOM_RCP-023__Blanco]  (value not drawn)  (mechanical)
BOM_B_SZCNT7__2  RCP-022__Rojo  [BOM_RCP-022__Rojo]  (value not drawn)  (mechanical)
BOM_B_SZCNT7__3  RCP-025__Azul  [BOM_RCP-025__Azul]  (value not drawn)  (mechanical)
BOM_B_SZCNT7__4  RCP-021__Negro  [BOM_RCP-021__Negro]  (value not drawn)  (mechanical)

### Notes on the sheet
- (near B_SZCNT7) 1
- (near B_SZCNT7) 2
- (near B_SZCNT7) 3
- (near B_SZCNT7) 4
- (near B_SZCNT7) 5
- 6
- 7

### Library data of the parts
B_SZCNT7 = SZCNT_0x_Macho: Conector SZCNT x vías macho para cable; Cod.DigiKey: Se compra a SZCNT; Cod.Fabricante: *; ComponentLink1Description: Manufacturer Link; ComponentLink1URL: *; DIGIKEYx100: *; Fabricante: SZCNT; DIGIKEYx50: *
BOM_B_SZCNT7__1 = RCP-023__Blanco: as A_RCA on sheet ProbadorDeCables_Accesorios_A_RCA; Cod.DigiKey: CP-1455-ND; Cod.Fabricante: RCP-023; ComponentLink1Description: Manufacturer Link; ComponentLink1URL: https://www.cuidevices.com/product/resource/digikeypdf/rcp-02x.pdf; DIGIKEYx50: 1.09940; DIGIKEYx100: 1.05160
BOM_B_SZCNT7__2 = RCP-022__Rojo: CONN RCA PLUG MONO 2COND; Fabricante: CUI Devices; Cod.DigiKey: CP-1454-ND; Cod.Fabricante: RCP-022; ComponentLink1Description: Manufacturer Link; ComponentLink1URL: https://www.cuidevices.com/product/resource/digikeypdf/rcp-02x.pdf; DIGIKEYx50: 1.09940; DIGIKEYx100: 1.05160
BOM_B_SZCNT7__3 = RCP-025__Azul: CONN RCA PLUG MONO 2COND; Fabricante: CUI Devices; Cod.DigiKey: CP-1457-ND; Cod.Fabricante: RCP-025; ComponentLink1Description: Manufacturer Link; ComponentLink1URL: https://www.cuidevices.com/product/resource/digikeypdf/rcp-02x.pdf; DIGIKEYx50: 1.09940; DIGIKEYx100: 1.05160
BOM_B_SZCNT7__4 = RCP-021__Negro: as BOM_B_SZCNT2 on sheet ProbadorDeCables_Accesorios_B_SZCNT_2; Cod.DigiKey: CP-1453-ND; Cod.Fabricante: RCP-021; ComponentLink1Description: Manufacturer Link; ComponentLink1URL: https://www.cuidevices.com/product/resource/digikeypdf/rcp-02x.pdf; DIGIKEYx50: 1.09940; DIGIKEYx100: 1.05160

## Sheet ProbadorDeCables_Accesorios_B_SZCNT_8.SchDoc
size A4
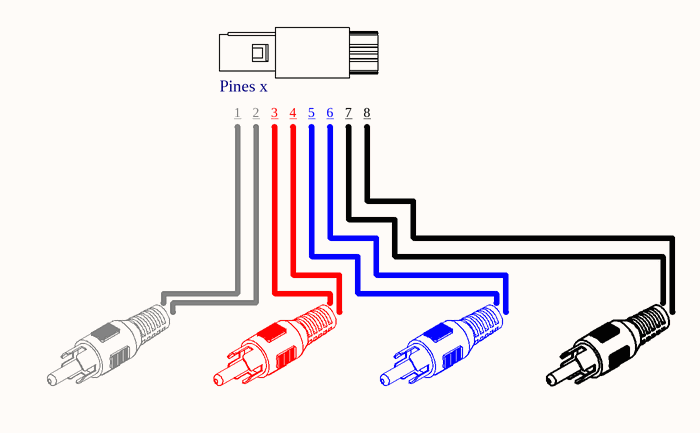
[diagram p7: ProbadorDeCables_Accesorios_B_SZCNT_8.SchDoc]

### Parts
B_SZCNT8  Pines: Pines x  [BOM_SZCNT_Macho]  (hidden comment: SZCNT_0x_Macho)  (mechanical)
BOM_B_SZCNT8__1  RCP-023__Blanco  [BOM_RCP-023__Blanco]  (value not drawn)  (mechanical)
BOM_B_SZCNT8__2  RCP-022__Rojo  [BOM_RCP-022__Rojo]  (value not drawn)  (mechanical)
BOM_B_SZCNT8__3  RCP-025__Azul  [BOM_RCP-025__Azul]  (value not drawn)  (mechanical)
BOM_B_SZCNT8__4  RCP-021__Negro  [BOM_RCP-021__Negro]  (value not drawn)  (mechanical)

### Notes on the sheet
- 1
- (near B_SZCNT8) 2
- (near B_SZCNT8) 3
- (near B_SZCNT8) 4
- (near B_SZCNT8) 5
- (near B_SZCNT8) 6
- 7
- 8

### Library data of the parts
B_SZCNT8 = SZCNT_0x_Macho: Conector SZCNT x vías macho para cable; Cod.DigiKey: Se compra a SZCNT; Cod.Fabricante: *; ComponentLink1Description: Manufacturer Link; ComponentLink1URL: *; DIGIKEYx100: *; Fabricante: SZCNT; DIGIKEYx50: *
BOM_B_SZCNT8__1 = RCP-023__Blanco: as A_RCA on sheet ProbadorDeCables_Accesorios_A_RCA; Cod.DigiKey: CP-1455-ND; Cod.Fabricante: RCP-023; ComponentLink1Description: Manufacturer Link; ComponentLink1URL: https://www.cuidevices.com/product/resource/digikeypdf/rcp-02x.pdf; DIGIKEYx50: 1.09940; DIGIKEYx100: 1.05160
BOM_B_SZCNT8__2 = RCP-022__Rojo: as BOM_B_SZCNT7__2 on sheet ProbadorDeCables_Accesorios_B_SZCNT_7; Cod.DigiKey: CP-1454-ND; Cod.Fabricante: RCP-022; ComponentLink1Description: Manufacturer Link; ComponentLink1URL: https://www.cuidevices.com/product/resource/digikeypdf/rcp-02x.pdf; DIGIKEYx50: 1.09940; DIGIKEYx100: 1.05160
BOM_B_SZCNT8__3 = RCP-025__Azul: as BOM_B_SZCNT7__3 on sheet ProbadorDeCables_Accesorios_B_SZCNT_7; Cod.DigiKey: CP-1457-ND; Cod.Fabricante: RCP-025; ComponentLink1Description: Manufacturer Link; ComponentLink1URL: https://www.cuidevices.com/product/resource/digikeypdf/rcp-02x.pdf; DIGIKEYx50: 1.09940; DIGIKEYx100: 1.05160
BOM_B_SZCNT8__4 = RCP-021__Negro: as BOM_B_SZCNT2 on sheet ProbadorDeCables_Accesorios_B_SZCNT_2; Cod.DigiKey: CP-1453-ND; Cod.Fabricante: RCP-021; ComponentLink1Description: Manufacturer Link; ComponentLink1URL: https://www.cuidevices.com/product/resource/digikeypdf/rcp-02x.pdf; DIGIKEYx50: 1.09940; DIGIKEYx100: 1.05160

## Sheet ProbadorDeCables_Accesorios_B_RCA.SchDoc
size A4
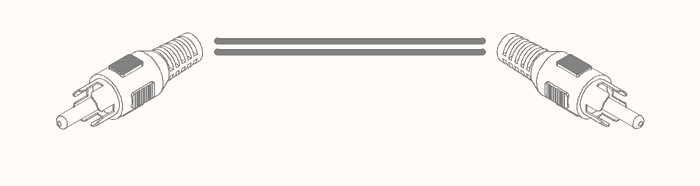
[diagram p8: ProbadorDeCables_Accesorios_B_RCA.SchDoc]

### Parts
B_RCA  RCP-023__Blanco  [BOM_RCP-023__Blanco]  (value not drawn)  (mechanical)
BOM_B_RCA__2  RCP-023__Blanco  [BOM_RCP-023__Blanco]  (value not drawn)  (mechanical)

### Library data of the parts
B_RCA BOM_B_RCA__2 = RCP-023__Blanco: as A_RCA on sheet ProbadorDeCables_Accesorios_A_RCA; Cod.DigiKey: CP-1455-ND; Cod.Fabricante: RCP-023; ComponentLink1Description: Manufacturer Link; ComponentLink1URL: https://www.cuidevices.com/product/resource/digikeypdf/rcp-02x.pdf; DIGIKEYx50: 1.09940; DIGIKEYx100: 1.05160

## Sheet ProbadorDeCables_Accesorios_B_CST100_Bomba.SchDoc
size A4
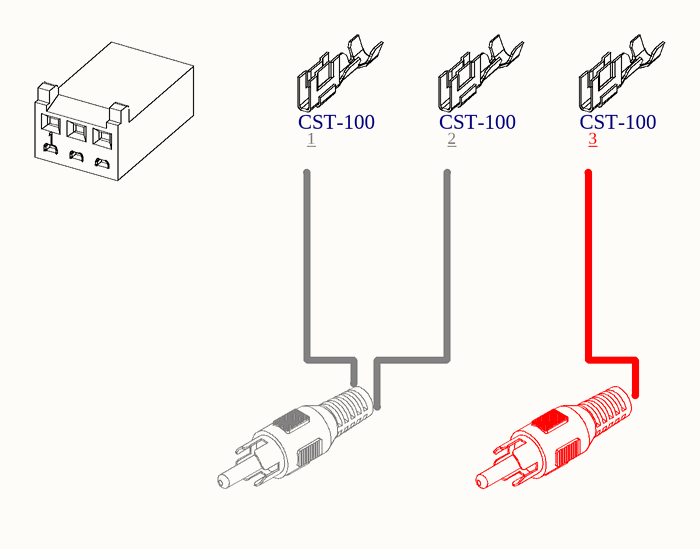
[diagram p9: ProbadorDeCables_Accesorios_B_CST100_Bomba.SchDoc]

### Parts
B_CST100  CST-100-3  [BOM_CST-100-3]  (value not drawn)  (mechanical)
BOM_B_CST100__1  RCP-023__Blanco  [BOM_RCP-023__Blanco]  (value not drawn)  (mechanical)
BOM_B_CST100__2  RCP-022__Rojo  [BOM_RCP-022__Rojo]  (value not drawn)  (mechanical)
BOM_B_CST100__3  ParaHousing: CST-100  [BOM_sock_CST_1375819-1]  (hidden comment: sock_CST_1375819-1)  (mechanical)
BOM_B_CST100__4  ParaHousing: CST-100  [BOM_sock_CST_1375819-1]  (hidden comment: sock_CST_1375819-1)  (mechanical)
BOM_B_CST100__5  ParaHousing: CST-100  [BOM_sock_CST_1375819-1]  (hidden comment: sock_CST_1375819-1)  (mechanical)

### Notes on the sheet
- (near BOM_B_CST100__4) 1
- (near BOM_B_CST100__5) 2
- 3

### Library data of the parts
B_CST100 = CST-100-3: CONN RCPT HSNG 3POS CST-100 II; Cod.Fabricante: 1375820-3; Fabricante: TE Connectivity AMP Connectors; Cod.DigiKey: A99614-ND; ComponentLink1Description: Manufacturer Link; ComponentLink1URL: https://www.te.com/commerce/DocumentDelivery/DDEController?Action=srchrtrv&DocNm=1375820&DocType=Customer+Drawing&DocLang=English; DIGIKEYx50: 0.12620; DIGIKEYx100: 0.11720
BOM_B_CST100__1 = RCP-023__Blanco: as A_RCA on sheet ProbadorDeCables_Accesorios_A_RCA; Cod.DigiKey: CP-1455-ND; Cod.Fabricante: RCP-023; ComponentLink1Description: Manufacturer Link; ComponentLink1URL: https://www.cuidevices.com/product/resource/digikeypdf/rcp-02x.pdf; DIGIKEYx50: 1.09940; DIGIKEYx100: 1.05160
BOM_B_CST100__2 = RCP-022__Rojo: as BOM_B_SZCNT7__2 on sheet ProbadorDeCables_Accesorios_B_SZCNT_7; Cod.DigiKey: CP-1454-ND; Cod.Fabricante: RCP-022; ComponentLink1Description: Manufacturer Link; ComponentLink1URL: https://www.cuidevices.com/product/resource/digikeypdf/rcp-02x.pdf; DIGIKEYx50: 1.09940; DIGIKEYx100: 1.05160
BOM_B_CST100__3-BOM_B_CST100__5 = sock_CST_1375819-1: as BOM__A34__1 on sheet ProbadorDeCables_Accesorios_A; Cod.DigiKey: A100453CT-ND; Cod.Fabricante: 1375819-1; ComponentLink1Description: Manufacturer Link; ComponentLink1URL: https://www.te.com/commerce/DocumentDelivery/DDEController?Action=srchrtrv&DocNm=1375819&DocType=Customer+Drawing&DocLang=English; DIGIKEYx100: 0.04210; DIGIKEYx50: 0.03960

## Sheet ProbadorDeCables_Accesorios_B_RJ11.SchDoc
size A4
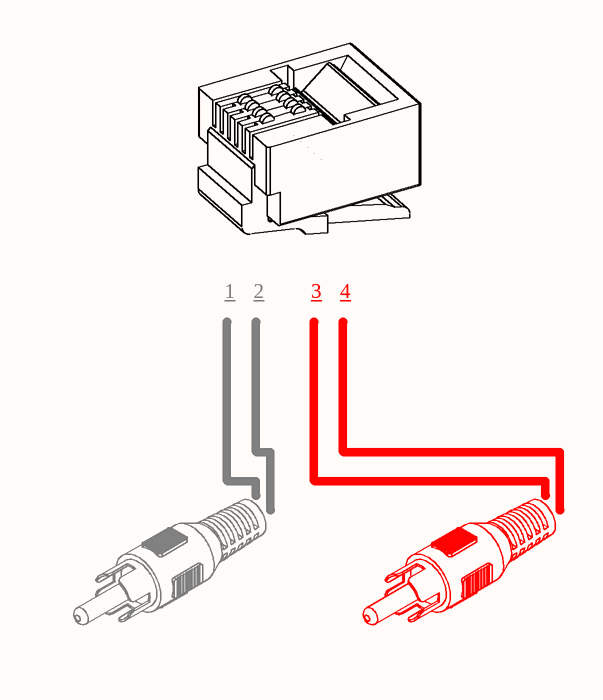
[diagram p10: ProbadorDeCables_Accesorios_B_RJ11.SchDoc]

### Parts
B_RJ11  RJ11 macho para cable  [BOM_RJ11-macho-para-cable]  (value not drawn)  (mechanical)
BOM_B_RJ11__1  RCP-023__Blanco  [BOM_RCP-023__Blanco]  (value not drawn)  (mechanical)
BOM_B_RJ11__2  RCP-022__Rojo  [BOM_RCP-022__Rojo]  (value not drawn)  (mechanical)

### Notes on the sheet
- 1
- 2
- 3
- 4

### Library data of the parts
B_RJ11 = RJ11 macho para cable: CONN MOD PLUG 6P4C UNSHIELDED; Cod.Fabricante: A-MO 6/4 SF; Fabricante: Assmann WSW Components; Cod.DigiKey: 123-A-MO6/4SF-ND; ComponentLink1Description: Manufacturer Link; ComponentLink1URL: http://www.assmann-wsw.com/fileadmin/datasheets/ASS_7278_CO.pdf; DIGIKEYx50: 0.18200; DIGIKEYx100: 0.16900
BOM_B_RJ11__1 = RCP-023__Blanco: as A_RCA on sheet ProbadorDeCables_Accesorios_A_RCA; Cod.DigiKey: CP-1455-ND; Cod.Fabricante: RCP-023; ComponentLink1Description: Manufacturer Link; ComponentLink1URL: https://www.cuidevices.com/product/resource/digikeypdf/rcp-02x.pdf; DIGIKEYx50: 1.09940; DIGIKEYx100: 1.05160
BOM_B_RJ11__2 = RCP-022__Rojo: as BOM_B_SZCNT7__2 on sheet ProbadorDeCables_Accesorios_B_SZCNT_7; Cod.DigiKey: CP-1454-ND; Cod.Fabricante: RCP-022; ComponentLink1Description: Manufacturer Link; ComponentLink1URL: https://www.cuidevices.com/product/resource/digikeypdf/rcp-02x.pdf; DIGIKEYx50: 1.09940; DIGIKEYx100: 1.05160

## Sheet ProbadorDeCables_Accesorios_B_Interlock.SchDoc
size A4
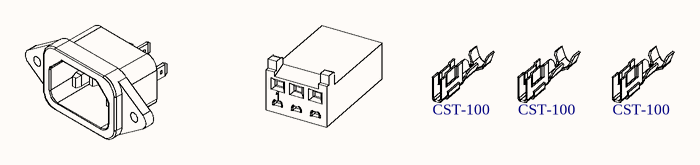
[diagram p11: ProbadorDeCables_Accesorios_B_Interlock.SchDoc]

### Parts
BOM_B50  Interlock macho para gabinete  [BOM_703W-00/04]  (value not drawn)  (mechanical)
BOM_B50__1  CST-100-3  [BOM_CST-100-3]  (value not drawn)  (mechanical)
BOM_B50__2  ParaHousing: CST-100  [BOM_sock_CST_1375819-1]  (hidden comment: sock_CST_1375819-1)  (mechanical)
BOM_B50__3  ParaHousing: CST-100  [BOM_sock_CST_1375819-1]  (hidden comment: sock_CST_1375819-1)  (mechanical)
BOM_B50__4  ParaHousing: CST-100  [BOM_sock_CST_1375819-1]  (hidden comment: sock_CST_1375819-1)  (mechanical)

### Library data of the parts
BOM_B50 = Interlock macho para gabinete: PWR ENT RCPT IEC320-C14 PANEL QC; Cod.Fabricante: 703W-00/04; Fabricante: Qualtek; Cod.DigiKey: Q212-ND; ComponentLink1Description: Manufacturer Link; ComponentLink1URL: http://www.qualtekusa.com/images/AC_Receptacles/pdfs/703w0004.pdf; DIGIKEYx50: 0.65460; DIGIKEYx100: 0.62610
BOM_B50__1 = CST-100-3: as B_CST100 on sheet ProbadorDeCables_Accesorios_B_CST100_Bomba; Cod.DigiKey: A99614-ND; ComponentLink1Description: Manufacturer Link; ComponentLink1URL: https://www.te.com/commerce/DocumentDelivery/DDEController?Action=srchrtrv&DocNm=1375820&DocType=Customer+Drawing&DocLang=English; DIGIKEYx50: 0.12620; DIGIKEYx100: 0.11720
BOM_B50__2-BOM_B50__4 = sock_CST_1375819-1: as BOM__A34__1 on sheet ProbadorDeCables_Accesorios_A; Cod.DigiKey: A100453CT-ND; Cod.Fabricante: 1375819-1; ComponentLink1Description: Manufacturer Link; ComponentLink1URL: https://www.te.com/commerce/DocumentDelivery/DDEController?Action=srchrtrv&DocNm=1375819&DocType=Customer+Drawing&DocLang=English; DIGIKEYx100: 0.04210; DIGIKEYx50: 0.03960

## Nets that join several sheets
Y16: ProbadorDeCables_Conexiones_A (A22.1), ProbadorDeCables_Conexiones_B (B35.2 B_Laser_2.8 B_Probador_2.8)